# EAGLE schematic csa_auxcpu-v1.0c (EAGLE 4.15)
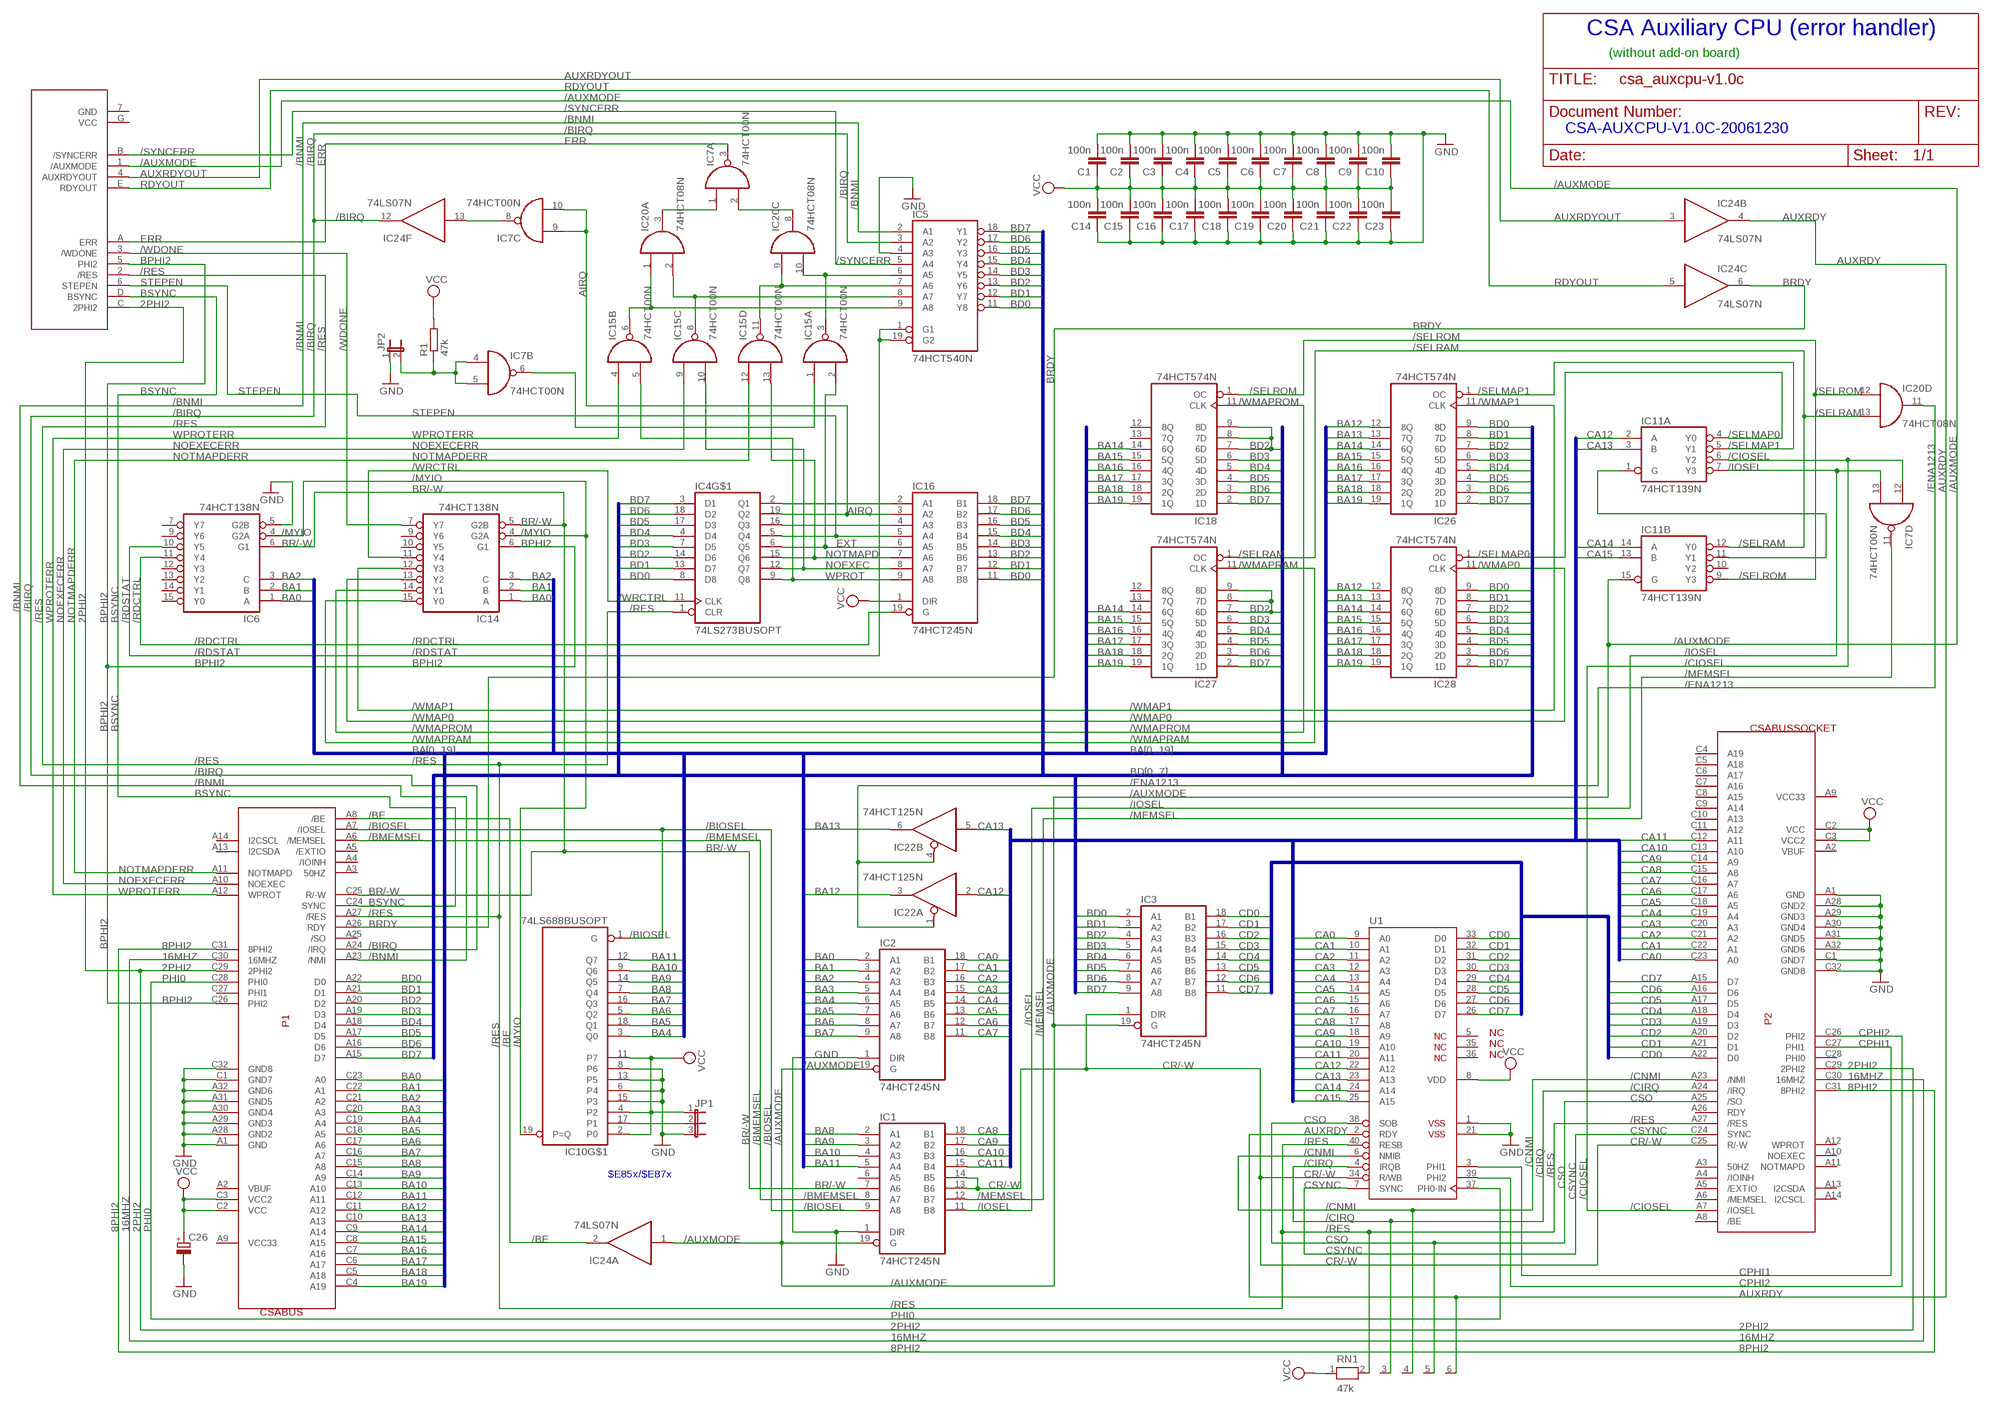
[diagram p0: schematic, sheet 1, part 1 of 2]
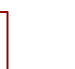
[diagram p1: schematic, sheet 1, part 2 of 2]

## Parts
C1  100n  C-EU025-025X050  [C025-025X050]
C2  100n  C-EU025-025X050  [C025-025X050]
C3  100n  C-EU025-025X050  [C025-025X050]
C4  100n  C-EU025-025X050  [C025-025X050]
C5  100n  C-EU025-025X050  [C025-025X050]
C6  100n  C-EU025-025X050  [C025-025X050]
C7  100n  C-EU025-025X050  [C025-025X050]
C8  100n  C-EU025-025X050  [C025-025X050]
C9  100n  C-EU025-025X050  [C025-025X050]
C10  100n  C-EU025-025X050  [C025-025X050]
C14  100n  C-EU025-025X050  [C025-025X050]
C15  100n  C-EU025-025X050  [C025-025X050]
C16  100n  C-EU025-025X050  [C025-025X050]
C17  100n  C-EU025-025X050  [C025-025X050]
C18  100n  C-EU025-025X050  [C025-025X050]
C19  100n  C-EU025-025X050  [C025-025X050]
C20  100n  C-EU025-025X050  [C025-025X050]
C21  100n  C-EU025-025X050  [C025-025X050]
C22  100n  C-EU025-025X050  [C025-025X050]
C23  100n  C-EU025-025X050  [C025-025X050]
C26  CPOL-EUE2.5-5  [E2,5-5]
IC1  74HCT245N  [DIL20]
IC2  74HCT245N  [DIL20]
IC3  74HCT245N  [DIL20]
IC4  74LS273BUSOPT  [DIL20]
IC5  74HCT540N  [DIL20]
IC6  74HCT138N  [DIL16]
IC7  74HCT00N  [DIL14]
IC10  74LS688BUSOPT  [DIL20]
IC11  74HCT139N  [DIL16]
IC14  74HCT138N  [DIL16]
IC15  74HCT00N  [DIL14]
IC16  74HCT245N  [DIL20]
IC18  74HCT574N  [DIL20]
IC20  74HCT08N  [DIL14]
IC22  74HCT125N  [DIL14]
IC24  74LS07N  [DIL14]
IC26  74HCT574N  [DIL20]
IC27  74HCT574N  [DIL20]
IC28  74HCT574N  [DIL20]
JP1  JP2E  [JP2]
JP2  JP1E  [JP1]
P1  CSABUS  [CSABUS]
P2  CSABUSSOCKET  [CSABUSSOCK]
P3  CSA_AUXCPU_ADDON  [FLAT14]
R1  47k  R-EU_0207/10  [0207/10]
RN1  47k  RN05  [RN-6]
U1  G65SC02P  [DIP-40]

## Nets
2PHI2: P1.C29(2PHI2) P2.C29(2PHI2) P3.C(2PHI2)
8PHI2: P1.C31(8PHI2) P2.C31(8PHI2)
16MHZ: P1.C30(16MHZ) P2.C30(16MHZ)
/AUXMODE: IC1.19(G) IC2.19(G) IC3.19(G) IC11.15(B:G) IC24.1(A:I) P3.1(/AUXMODE)
/BE: IC24.2(A:O) P1.A8(/BE)
/BIOSEL: IC1.9(A8) IC10.1(G) P1.A7(/IOSEL)
/BIRQ: IC5.3(A2) IC24.12(F:O) P1.A24(/IRQ)
/BMEMSEL: IC1.8(A7) P1.A6(/MEMSEL)
/BNMI: IC5.2(A1) P1.A23(/NMI)
/CIOSEL: IC7.12(D:I0) IC11.6(A:Y2) P2.A7(/IOSEL)
/CIRQ: P2.A24(/IRQ) RN1.3 U1.4(IRQB)
/CNMI: P2.A23(/NMI) RN1.4 U1.6(NMIB)
/ENA1213: IC20.11(D:O) IC22.1(A:OE) IC22.4(B:OE)
/IOSEL: IC1.11(B8) IC7.13(D:I1) IC11.7(A:Y3)
/MEMSEL: IC1.12(B7) IC7.11(D:O)
/MYIO: IC6.4(G2A) IC10.19(P=Q) IC14.4(G2A)
/RDCTRL: IC6.11(Y4) IC16.19(G)
/RDSTAT: IC5.1(G1) IC5.19(G2) IC6.10(Y5)
/RES: IC4.1(CLR) P1.A27(/RES) P2.A27(/RES) P3.2(/RES) RN1.2 U1.40(RESB)
/SELMAP0: IC11.4(A:Y0) IC28.1(OC)
/SELMAP1: IC11.5(A:Y1) IC26.1(OC)
/SELRAM: IC11.12(B:Y0) IC20.13(D:I1) IC27.1(OC)
/SELROM: IC11.9(B:Y3) IC18.1(OC) IC20.12(D:I0)
/SYNCERR: IC5.5(A4) P3.B(/SYNCERR)
/WDONE: IC14.7(Y7) P3.3(/WDONE)
/WMAP0: IC14.13(Y2) IC28.11(CLK)
/WMAP1: IC14.12(Y3) IC26.11(CLK)
/WMAPRAM: IC14.15(Y0) IC27.11(CLK)
/WMAPROM: IC14.14(Y1) IC18.11(CLK)
/WRCTRL: IC4.11(CLK) IC14.11(Y4)
AIRQ: IC4.19(Q2) IC7.9(C:I0) IC7.10(C:I1) IC16.3(A2)
AUXRDY: IC24.4(B:O) RN1.6 U1.2(RDY)
AUXRDYOUT: IC24.3(B:I) P3.4(AUXRDYOUT)
BA0: IC2.2(A1) IC6.1(A) IC14.1(A) P1.C23(A0)
BA1: IC2.3(A2) IC6.2(B) IC14.2(B) P1.C22(A1)
BA2: IC2.4(A3) IC6.3(C) IC14.3(C) P1.C21(A2)
BA3: IC2.5(A4) P1.C20(A3)
BA4: IC2.6(A5) IC10.3(Q0) P1.C19(A4)
BA5: IC2.7(A6) IC10.18(Q1) P1.C18(A5)
BA6: IC2.8(A7) IC10.5(Q2) P1.C17(A6)
BA7: IC2.9(A8) IC10.16(Q3) P1.C16(A7)
BA8: IC1.2(A1) IC10.7(Q4) P1.C15(A8)
BA9: IC1.3(A2) IC10.14(Q5) P1.C14(A9)
BA10: IC1.4(A3) IC10.9(Q6) P1.C13(A10)
BA11: IC1.5(A4) IC10.12(Q7) P1.C12(A11)
BA12: IC22.3(A:O) IC26.12(8Q) IC28.12(8Q) P1.C11(A12)
BA13: IC22.6(B:O) IC26.13(7Q) IC28.13(7Q) P1.C10(A13)
BA14: IC18.14(6Q) IC26.14(6Q) IC27.14(6Q) IC28.14(6Q) P1.C9(A14)
BA15: IC18.15(5Q) IC26.15(5Q) IC27.15(5Q) IC28.15(5Q) P1.C8(A15)
BA16: IC18.16(4Q) IC26.16(4Q) IC27.16(4Q) IC28.16(4Q) P1.C7(A16)
BA17: IC18.17(3Q) IC26.17(3Q) IC27.17(3Q) IC28.17(3Q) P1.C6(A17)
BA18: IC18.18(2Q) IC26.18(2Q) IC27.18(2Q) IC28.18(2Q) P1.C5(A18)
BA19: IC18.19(1Q) IC26.19(1Q) IC27.19(1Q) IC28.19(1Q) P1.C4(A19)
BD0: IC3.2(A1) IC4.8(D8) IC5.11(Y8) IC16.11(B8) IC26.9(8D) IC28.9(8D) P1.A22(D0)
BD1: IC3.3(A2) IC4.13(D7) IC5.12(Y7) IC16.12(B7) IC26.8(7D) IC28.8(7D) P1.A21(D1)
BD2: IC3.4(A3) IC4.14(D6) IC5.13(Y6) IC16.13(B6) IC18.7(6D) IC18.8(7D) IC18.9(8D) IC26.7(6D) IC27.7(6D) IC27.8(7D) IC27.9(8D) IC28.7(6D) P1.A20(D2)
BD3: IC3.5(A4) IC4.7(D5) IC5.14(Y5) IC16.14(B5) IC18.6(5D) IC26.6(5D) IC27.6(5D) IC28.6(5D) P1.A19(D3)
BD4: IC3.6(A5) IC4.4(D4) IC5.15(Y4) IC16.15(B4) IC18.5(4D) IC26.5(4D) IC27.5(4D) IC28.5(4D) P1.A18(D4)
BD5: IC3.7(A6) IC4.17(D3) IC5.16(Y3) IC16.16(B3) IC18.4(3D) IC26.4(3D) IC27.4(3D) IC28.4(3D) P1.A17(D5)
BD6: IC3.8(A7) IC4.18(D2) IC5.17(Y2) IC16.17(B2) IC18.3(2D) IC26.3(2D) IC27.3(2D) IC28.3(2D) P1.A16(D6)
BD7: IC3.9(A8) IC4.3(D1) IC5.18(Y1) IC16.18(B1) IC18.2(1D) IC26.2(1D) IC27.2(1D) IC28.2(1D) P1.A15(D7)
BPHI2: IC14.6(G1) P1.C26(PHI2) P3.5(PHI2)
BR/-W: IC1.7(A6) IC6.6(G1) IC14.5(G2B) P1.C25(R/-W)
BRDY: IC24.6(C:O) P1.A26(RDY)
BSYNC: P1.C24(SYNC) P3.D(BSYNC)
CA0: IC2.18(B1) P2.C23(A0) U1.9(A0)
CA1: IC2.17(B2) P2.C22(A1) U1.10(A1)
CA2: IC2.16(B3) P2.C21(A2) U1.11(A2)
CA3: IC2.15(B4) P2.C20(A3) U1.12(A3)
CA4: IC2.14(B5) P2.C19(A4) U1.13(A4)
CA5: IC2.13(B6) P2.C18(A5) U1.14(A5)
CA6: IC2.12(B7) P2.C17(A6) U1.15(A6)
CA7: IC2.11(B8) P2.C16(A7) U1.16(A7)
CA8: IC1.18(B1) P2.C15(A8) U1.17(A8)
CA9: IC1.17(B2) P2.C14(A9) U1.18(A9)
CA10: IC1.16(B3) P2.C13(A10) U1.19(A10)
CA11: IC1.15(B4) P2.C12(A11) U1.20(A11)
CA12: IC11.2(A:A) IC22.2(A:I) U1.22(A12)
CA13: IC11.3(A:B) IC22.5(B:I) U1.23(A13)
CA14: IC11.14(B:A) U1.24(A14)
CA15: IC11.13(B:B) U1.25(A15)
CD0: IC3.18(B1) P2.A22(D0) U1.33(D0)
CD1: IC3.17(B2) P2.A21(D1) U1.32(D1)
CD2: IC3.16(B3) P2.A20(D2) U1.31(D2)
CD3: IC3.15(B4) P2.A19(D3) U1.30(D3)
CD4: IC3.14(B5) P2.A18(D4) U1.29(D4)
CD5: IC3.13(B6) P2.A17(D5) U1.28(D5)
CD6: IC3.12(B7) P2.A16(D6) U1.27(D6)
CD7: IC3.11(B8) P2.A15(D7) U1.26(D7)
CPHI1: P2.C27(PHI1) U1.3(PHI1)
CPHI2: P2.C26(PHI2) U1.39(PHI2)
CR/-W: IC1.13(B6) IC1.14(B5) IC3.1(DIR) P2.C25(R/-W) U1.34(R/WB)
CSO: P2.A25(/SO) RN1.5 U1.38(SOB)
CSYNC: P2.C24(SYNC) U1.7(SYNC)
ERR: IC7.3(A:O) P3.A(ERR)
EXT: IC4.6(Q5) IC15.2(A:I1) IC16.6(A5)
GND: C1.2 C2.2 C3.2 C4.2 C5.2 C6.2 C7.2 C8.2 C9.2 C10.2 C14.1 C15.1 C16.1 C17.1 C18.1 C19.1 C20.1 C21.1 C22.1 C23.1 C26.- IC1.1(DIR) IC2.1(DIR) IC5.4(A3) IC6.5(G2B) IC10.6(P4) IC10.8(P6) IC10.13(P5) IC10.15(P3) JP1.3 JP2.1 P1.A1(GND) P1.A28(GND2) P1.A29(GND3) P1.A30(GND4) P1.A31(GND5) P1.A32(GND6) P1.C1(GND7) P1.C32(GND8) P2.A1(GND) P2.A28(GND2) P2.A29(GND3) P2.A30(GND4) P2.A31(GND5) P2.A32(GND6) P2.C1(GND7) P2.C32(GND8) U1.1(VSS$1) U1.21(VSS$2)
N$1: IC7.8(C:O) IC24.13(F:I)
N$2: IC4.2(Q1) IC16.2(A1)
N$3: IC11.1(A:G) IC11.11(B:Y1)
N$8: IC4.16(Q3) IC16.4(A3)
N$19: IC10.17(P1) JP1.2
N$40: IC7.6(B:O) IC15.1(A:I0)
N$48: IC5.9(A8) IC15.6(B:O) IC20.1(A:I0)
N$59: IC5.8(A7) IC15.8(C:O) IC20.2(A:I1)
N$61: IC5.7(A6) IC15.11(D:O) IC20.9(C:I0)
N$62: IC5.6(A5) IC15.3(A:O) IC20.10(C:I1)
N$63: IC7.1(A:I0) IC20.3(A:O)
N$64: IC7.2(A:I1) IC20.8(C:O)
N$66: IC7.4(B:I0) IC7.5(B:I1) JP2.2 R1.1
NOEXEC: IC4.12(Q7) IC15.10(C:I1) IC16.8(A7)
NOEXECERR: IC15.9(C:I0) P1.A10(NOEXEC)
NOTMAPD: IC4.15(Q6) IC15.13(D:I1) IC16.7(A6)
NOTMAPDERR: IC15.12(D:I0) P1.A11(NOTMAPD)
PHI0: P1.C28(PHI0) U1.37(PH0-IN)
RDYOUT: IC24.5(C:I) P3.E(RDYOUT)
STEPEN: IC4.5(Q4) IC16.5(A4) P3.6(STEPEN)
VCC: C1.1 C2.1 C3.1 C4.1 C5.1 C6.1 C7.1 C8.1 C9.1 C10.1 C14.2 C15.2 C16.2 C17.2 C18.2 C19.2 C20.2 C21.2 C22.2 C23.2 C26.+ IC10.2(P0) IC10.4(P2) IC10.11(P7) IC16.1(DIR) JP1.1 P1.C2(VCC) P1.C3(VCC2) P2.C2(VCC) P2.C3(VCC2) R1.2 RN1.1 U1.8(VDD)
WPROT: IC4.9(Q8) IC15.5(B:I1) IC16.9(A8)
WPROTERR: IC15.4(B:I0) P1.A12(WPROT)
Unconnected: IC1.6(A5) IC6.7(Y7) IC6.9(Y6) IC6.12(Y3) IC6.13(Y2) IC6.14(Y1) IC6.15(Y0) IC11.10(B:Y2) IC14.9(Y6) IC14.10(Y5) IC18.12(8Q) IC18.13(7Q) IC20.4(B:I0) IC20.5(B:I1) IC20.6(B:O) IC22.8(C:O) IC22.9(C:I) IC22.10(C:OE) IC22.11(D:O) IC22.12(D:I) IC22.13(D:OE) IC24.8(D:O) IC24.9(D:I) IC24.10(E:O) IC24.11(E:I) IC27.12(8Q) IC27.13(7Q) P1.A2(VBUF) P1.A3(50HZ) P1.A4(/IOINH) P1.A5(/EXTIO) P1.A9(VCC33) P1.A13(I2CSDA) P1.A14(I2CSCL) P1.A25(/SO) P1.C27(PHI1) P2.A2(VBUF) P2.A3(50HZ) P2.A4(/IOINH) P2.A5(/EXTIO) P2.A6(/MEMSEL) P2.A8(/BE) P2.A9(VCC33) P2.A10(NOEXEC) P2.A11(NOTMAPD) P2.A12(WPROT) P2.A13(I2CSDA) P2.A14(I2CSCL) P2.A26(RDY) P2.C4(A19) P2.C5(A18) P2.C6(A17) P2.C7(A16) P2.C8(A15) P2.C9(A14) P2.C10(A13) P2.C11(A12) P2.C28(PHI0) U1.5(NC$1) U1.35(NC$2) U1.36(NC$3)

## Buses
BA[0..19]
BD[0..7]
CD[0..7]
CA[0..15]

## Notes on the sheet
- CSA Auxiliary CPU (error handler)
- (without add-on board)
- CSA-AUXCPU-V1.0C-20061230
- $E85x/$E87x

## Power pins joined to a net without a drawn wire
GND: IC1.10(GND) IC2.10(GND) IC3.10(GND) IC4.10(GND) IC5.10(GND) IC6.8(GND) IC7.7(P:GND) IC10.10(GND) IC11.8(P:GND) IC14.8(GND) IC15.7(P:GND) IC16.10(GND) IC18.10(GND) IC20.7(P:GND) IC22.7(P:GND) IC24.7(P:GND) IC26.10(GND) IC27.10(GND) IC28.10(GND) P3.7(GND)
VCC: IC1.20(VCC) IC2.20(VCC) IC3.20(VCC) IC4.20(VCC) IC5.20(VCC) IC6.16(VCC) IC7.14(P:VCC) IC10.20(VCC) IC11.16(P:VCC) IC14.16(VCC) IC15.14(P:VCC) IC16.20(VCC) IC18.20(VCC) IC20.14(P:VCC) IC22.14(P:VCC) IC24.14(P:VCC) IC26.20(VCC) IC27.20(VCC) IC28.20(VCC) P3.G(VCC)

## Library data of the parts
C1-C10 C14-C23 = rcl:C-EU: CAPACITOR, European symbol
C26 = rcl:CPOL-EU: POLARIZED CAPACITOR, European symbol
IC1-IC3 IC16 = 74xx-eu:74*245: Octal BUS TRANSCEIVER, 3-state
IC4 = csa:74LS273BUSOPT
IC5 = 74xx-eu:74*540: Octal BUFFER and LINE DRIVER, 3-state
IC6 IC14 = 74xx-eu:74*138: 3-line to 8-line DECODER/DEMULTIPLEXER
IC7 IC15 = 74xx-eu:74*00: Quad 2-input NAND gate
IC10 = csa:74LS688BUSOPT
IC11 = 74xx-eu:74*139: Dual 2-line to 4-line DECODER/DEMULTIPLEXER
IC18 IC26-IC28 = 74xx-eu:74*574: 8-bit D type FLIP FLOP bus driver
IC20 = 74xx-eu:74*08: Quad 2-input AND gate
IC22 = 74xx-eu:74*125: Quad bus BUFFER, 3-state
IC24 = 74xx-eu:74*07: Hex BUFFER, open collector high-voltage output
JP1 = jumper:JP2E: JUMPER
JP2 = jumper:JP1E: JUMPER
P1 P2 = csa:CSABUS
P3 = csa:CSA_AUXCPU_ADDON
R1 = rcl:R-EU_: RESISTOR, European symbol
RN1 = resistor-net:RN05: RESISTOR NETWORK
U1 = 65xxx:G65SC02P: California Micro Devices Version